# Altium project X-FBAPE.PrjPcb
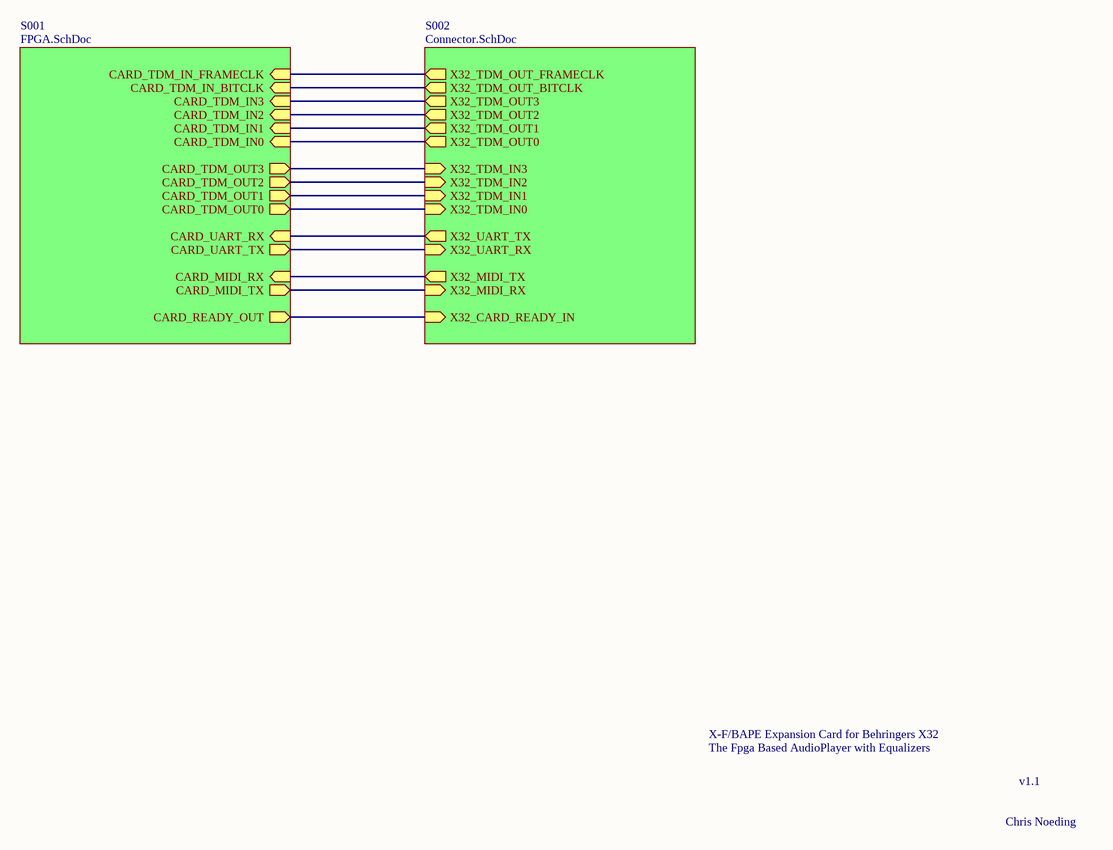
[diagram p0: Top.SchDoc]
3 sheets, 49 parts. Net scope: hierarchical (ports join the sheet entries above them; power ports are global).
Board file: X-FBAPE.PcbDoc
Sheets:
  Top.SchDoc
    S001 = FPGA.SchDoc
    S002 = Connector.SchDoc

## Sheet Top.SchDoc
size A4; SheetNumber: 1; SheetTotal: 3

### Sub-sheets
S001 = FPGA.SchDoc: CARD_TDM_IN_FRAMECLK (in), CARD_TDM_IN_BITCLK (in), CARD_TDM_IN3 (in), CARD_TDM_IN2 (in), CARD_TDM_IN1 (in), CARD_TDM_IN0 (in), CARD_TDM_OUT3 (out), CARD_TDM_OUT2 (out), CARD_TDM_OUT1 (out), CARD_TDM_OUT0 (out), CARD_UART_RX (in), CARD_UART_TX (out), CARD_MIDI_RX (in), CARD_MIDI_TX (out), CARD_READY_OUT (out)
S002 = Connector.SchDoc: X32_TDM_OUT_FRAMECLK (out), X32_TDM_OUT_BITCLK (out), X32_TDM_OUT3 (out), X32_TDM_OUT2 (out), X32_TDM_OUT1 (out), X32_TDM_OUT0 (out), X32_TDM_IN3 (in), X32_TDM_IN2 (in), X32_TDM_IN1 (in), X32_TDM_IN0 (in), X32_UART_TX (out), X32_UART_RX (in), X32_MIDI_TX (out), X32_MIDI_RX (in), X32_CARD_READY_IN (in)

### Nets
NetJ202_20: sheet S001/CARD_UART_TX, sheet S002/X32_UART_RX
NetJ202_21: sheet S001/CARD_UART_RX, sheet S002/X32_UART_TX
NetJ203_6: sheet S001/CARD_TDM_IN_FRAMECLK, sheet S002/X32_TDM_OUT_FRAMECLK
NetJ203_7: sheet S001/CARD_TDM_IN_BITCLK, sheet S002/X32_TDM_OUT_BITCLK
NetJ203_8: sheet S001/CARD_TDM_IN0, sheet S002/X32_TDM_OUT0
NetJ203_9: sheet S001/CARD_TDM_IN1, sheet S002/X32_TDM_OUT1
NetJ203_10: sheet S001/CARD_TDM_IN2, sheet S002/X32_TDM_OUT2
NetJ203_11: sheet S001/CARD_TDM_IN3, sheet S002/X32_TDM_OUT3
NetJ203_12: sheet S001/CARD_READY_OUT, sheet S002/X32_CARD_READY_IN
NetJ203_21: sheet S001/CARD_MIDI_TX, sheet S002/X32_MIDI_RX
NetJ203_22: sheet S001/CARD_MIDI_RX, sheet S002/X32_MIDI_TX
NetJ203_23: sheet S001/CARD_TDM_OUT3, sheet S002/X32_TDM_IN3
NetJ203_24: sheet S001/CARD_TDM_OUT2, sheet S002/X32_TDM_IN2
NetJ203_25: sheet S001/CARD_TDM_OUT1, sheet S002/X32_TDM_IN1
NetJ203_26: sheet S001/CARD_TDM_OUT0, sheet S002/X32_TDM_IN0

### Notes on the sheet
- X-F/BAPE Expansion Card for Behringers X32
- The Fpga Based AudioPlayer with Equalizers
- v1.1
- Chris Noeding

## Sheet FPGA.SchDoc
size A4; SheetNumber: 2; SheetTotal: 3
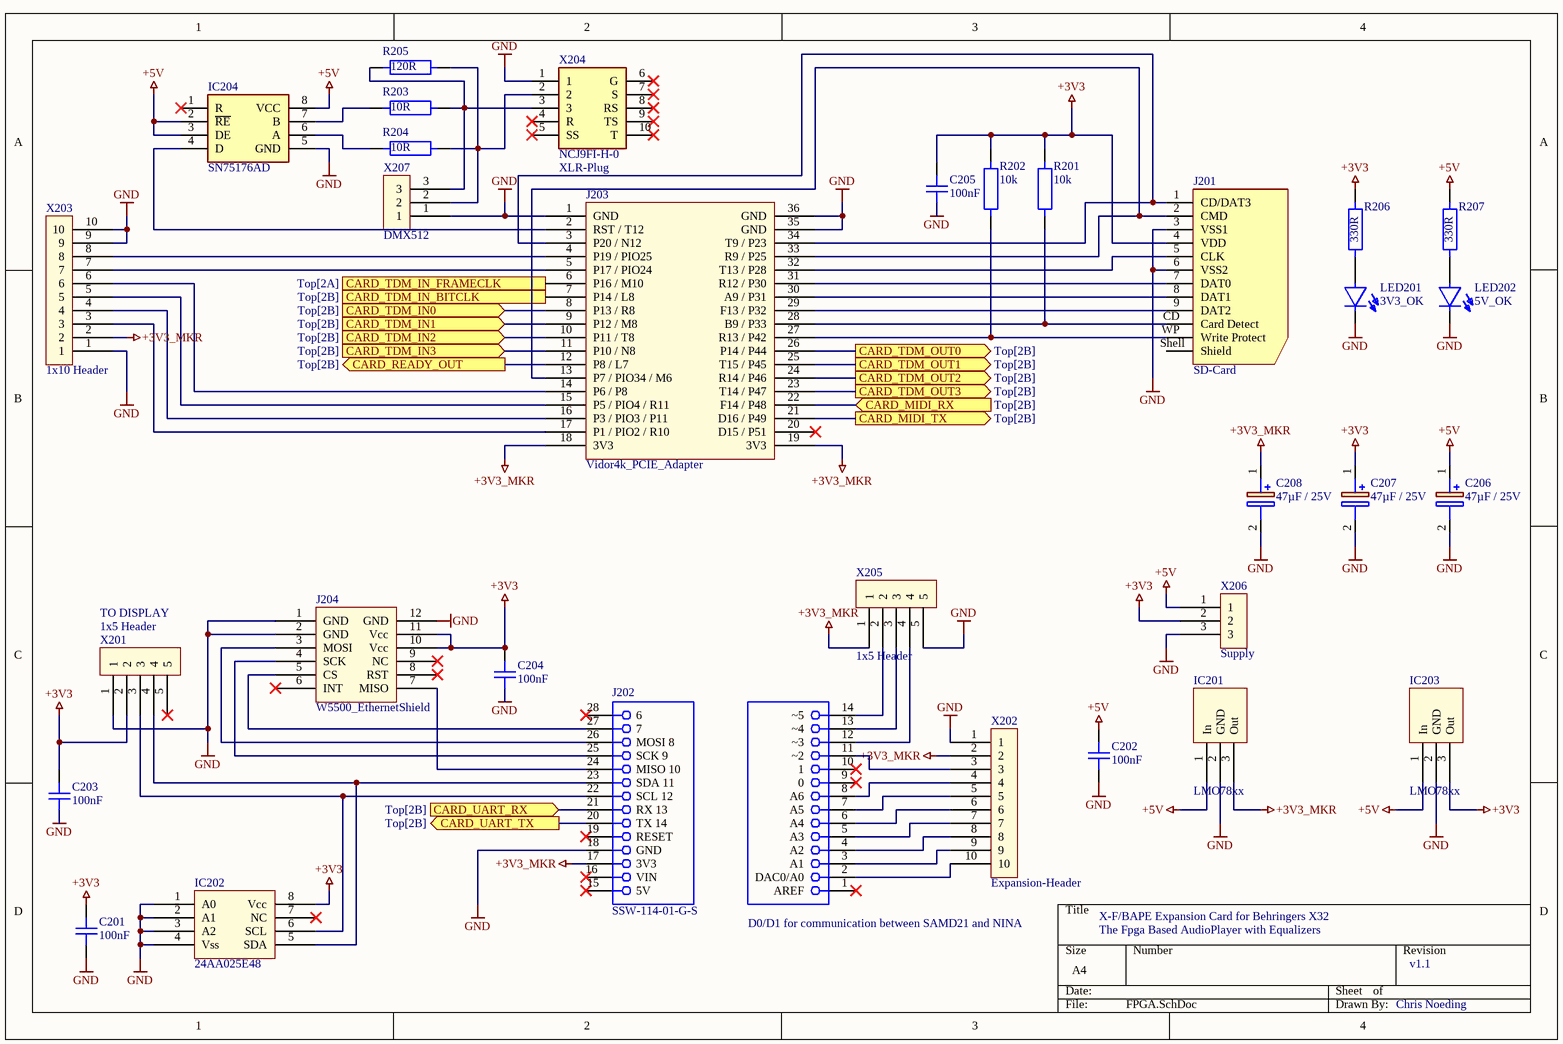
[diagram p1: FPGA.SchDoc]

### Parts
C201  100nF  [1206]
C202  100nF  [1206]
C203  100nF  [1206]
C204  100nF  [1206]
C205  100nF  [1206]
C206  47µF / 25V  [CAPPRD200W50D550H1250]
C207  47µF / 25V  [CAPPRD200W50D550H1250]
C208  47µF / 25V  [CAPPRD200W50D550H1250]
IC201  LMO78xx  [LMO78xx]
IC202  24AA025E48  [SOIC-8]
IC203  LMO78xx  [LMO78xx]
IC204  SN75176AD  [SOIC127P600X175-8N]
J201  693061010911  [693061010911]  (value not drawn)
J202  SSW-114-01-G-S  [SMTC-SSW-114-01-X-S]
J203  Vidor4k_PCIE_Adapter  [Vidor4K_PCIE_Adapter]
J204  W5500_EthernetShield  [W5500_EthernetShield]
LED201  3V3_OK  [LED 3MM]
LED202  5V_OK  [LED 3MM]
R201  10k  [1206]
R202  10k  [1206]
R203  10R  [1206]
R204  10R  [1206]
R205  120R  [1206]
R206  330R  [1206]
R207  330R  [1206]
X201  1x5 Header  [1x5 Header]
X202  Expansion-Header  [1x10 Header]
X203  1x10 Header  [1x10 Header]
X204  NCJ9FI-H-0  [NCJ9FIH0]
X205  1x5 Header  [1x5 Header]
X206  Supply  [1x3 Jumper]
X207  DMX512  [1x3 Jumper]

### Ports
CARD_MIDI_RX (in, see Top[2B]), CARD_MIDI_TX (out, see Top[2B]), CARD_READY_OUT (out, see Top[2B]), CARD_TDM_IN0 (in, see Top[2B]), CARD_TDM_IN1 (in, see Top[2B]), CARD_TDM_IN2 (in, see Top[2B]), CARD_TDM_IN3 (in, see Top[2B]), CARD_TDM_IN_BITCLK (in, see Top[2B]), CARD_TDM_IN_FRAMECLK (in, see Top[2A]), CARD_TDM_OUT0 (out, see Top[2B]), CARD_TDM_OUT1 (out, see Top[2B]), CARD_TDM_OUT2 (out, see Top[2B]), CARD_TDM_OUT3 (out, see Top[2B]), CARD_UART_RX (in, see Top[2B]), CARD_UART_TX (out, see Top[2B])

### Nets
+3V3: C201.1 C203.1 C204.1 C205.1 C207.1(+) IC202.8(Vcc) IC203.3(Out) J201.4(VDD) J204.10(Vcc) J204.11(Vcc) R201.2 R202.2 R206.1 X201.2 X206.2
+3V3_MKR: C208.1(+) IC201.3(Out) J202.17(3V3) J203.18(3V3) J203.19(3V3) X202.2 X203.2 X205.1
+5V: C202.1 C206.1(+) IC201.1(In) IC203.1(In) IC204.2(~{RE}) IC204.3(DE) IC204.8(VCC) R207.1 X206.1
GND: C201.2 C202.2 C203.2 C204.2 C205.2 C206.2(-) C207.2(-) C208.2(-) IC201.2(GND) IC202.1(A0) IC202.2(A1) IC202.3(A2) IC202.4(Vss) IC203.2(GND) IC204.5(GND) J201.3(VSS1) J201.6(VSS2) J202.18(GND) J203.1(GND) J203.35(GND) J203.36(GND) J204.1(GND) J204.2(GND) J204.12(GND) LED201.2 LED202.2 X201.1 X202.1 X203.1 X203.9 X203.10 X204.1 X205.5 X206.3 X207.1
NetIC202_5: IC202.5(SDA) J202.23(SDA_11) X201.4
NetIC202_6: IC202.6(SCL) J202.22(SCL_12) X201.3
NetIC204_4: IC204.4(D) J203.2(RST_/_T12)
NetIC204_6: IC204.6(A) R204.1
NetIC204_7: IC204.7(B) R203.1
NetJ201_1: J201.1(CD/DAT3) J203.3(P20_/_N12) J203.34(T9_/_P23)
NetJ201_2: J201.2(CMD) J203.13(P7_/_PIO34_/_M6) J203.33(R9_/_P25)
NetJ201_5: J201.5(CLK) J203.32(T13_/_P28)
NetJ201_7: J201.7(DAT0) J203.31(R12_/_P30)
NetJ201_8: J201.8(DAT1) J203.30(A9_/_P31)
NetJ201_9: J201.9(DAT2) J203.29(F13_/_P32)
NetJ201_CD: J201.CD(Card_Detect) J203.28(B9_/_P33) R201.1
NetJ201_WP: J201.WP(Write_Protect) J203.27(R13_/_P42) R202.1
NetJ202_2: J202.2(DAC0/A0) X202.10
NetJ202_3: J202.3(A1) X202.9
NetJ202_4: J202.4(A2) X202.8
NetJ202_5: J202.5(A3) X202.7
NetJ202_6: J202.6(A4) X202.6
NetJ202_7: J202.7(A5) X202.5
NetJ202_8: J202.8(A6) X202.4
NetJ202_11: J202.11(~2) X202.3
NetJ202_12: J202.12(~3) X205.4
NetJ202_13: J202.13(~4) X205.3
NetJ202_14: J202.14(~5) X205.2
NetJ202_20: J202.20(TX_14) ; port CARD_UART_TX
NetJ202_21: J202.21(RX_13) ; port CARD_UART_RX
NetJ202_24: J202.24(MISO_10) J204.7(MISO)
NetJ202_25: J202.25(SCK_9) J204.4(SCK)
NetJ202_26: J202.26(MOSI_8) J204.3(MOSI)
NetJ202_27: J202.27(7) J204.5(CS)
NetJ203_4: J203.4(P19_/_PIO25) X203.8
NetJ203_5: J203.5(P17_/_PIO24) X203.7
NetJ203_6: J203.6(P16_/_M10) ; port CARD_TDM_IN_FRAMECLK
NetJ203_7: J203.7(P14_/_L8) ; port CARD_TDM_IN_BITCLK
NetJ203_8: J203.8(P13_/_R8) ; port CARD_TDM_IN0
NetJ203_9: J203.9(P12_/_M8) ; port CARD_TDM_IN1
NetJ203_10: J203.10(P11_/_T8) ; port CARD_TDM_IN2
NetJ203_11: J203.11(P10_/_N8) ; port CARD_TDM_IN3
NetJ203_12: J203.12(P8_/_L7) ; port CARD_READY_OUT
NetJ203_14: J203.14(P6_/_P8) X203.6
NetJ203_15: J203.15(P5_/_PIO4_/_R11) X203.5
NetJ203_16: J203.16(P3_/_PIO3_/_P11) X203.4
NetJ203_17: J203.17(P1_/_PIO2_/_R10) X203.3
NetJ203_21: J203.21(D16_/_P49) ; port CARD_MIDI_TX
NetJ203_22: J203.22(F14_/_P48) ; port CARD_MIDI_RX
NetJ203_23: J203.23(T14_/_P47) ; port CARD_TDM_OUT3
NetJ203_24: J203.24(R14_/_P46) ; port CARD_TDM_OUT2
NetJ203_25: J203.25(T15_/_P45) ; port CARD_TDM_OUT1
NetJ203_26: J203.26(P14_/_P44) ; port CARD_TDM_OUT0
NetLED201_1: LED201.1 R206.2
NetLED202_1: LED202.1 R207.2
NetR203_2: R203.2 R205.1 X204.3 X207.3
NetR204_2: R204.2 R205.2 X204.2 X207.2

Not connected (* = marked no-connect by the designer): IC202 7(NC)*; IC204 1(R)*; J201 Shell(Shield); J202 1(AREF)* 9(0)* 10(1)* 15(5V)* 16(VIN)* 19(RESET)* 28(6)*; J203 20(D15_/_P51)*; J204 6(INT)* 8(RST)* 9(NC)*; X201 5*; X204 4(R)* 5(SS)* 6(G)* 7(S)* 8(RS)* 9(TS)* 10(T)*

### Notes on the sheet
- XLR-Plug
- (near J201) SD-Card
- TO DISPLAY
- (near J202) D0/D1 for communication between SAMD21 and NINA
- X-F/BAPE Expansion Card for Behringers X32
- The Fpga Based AudioPlayer with Equalizers
- v1.1
- Chris Noeding

### Library data of the parts
C201-C205 = 1206_C_1nF/63V: 1206_C; Text Field1: 06-23225; SMA-ArtikelNr: *
C206-C208 = MAL214256479E3: Capacitor Polarised; Manufacturer_Name: Vishay; Datasheet Link: https://www.vishay.com/docs/28402/142rhs.pdf; Height: 12.5mm; Manufacturer_Part_Number: MAL214256479E3
IC204 = SN75176AD: Integrated Circuit; Manufacturer_Name: Texas Instruments; Datasheet Link: http://www.ti.com/lit/ds/symlink/sn75176a.pdf; Height: 1.75mm; Manufacturer_Part_Number: SN75176AD; Mouser Part Number: 595-SN75176AD; Mouser Price/Stock: https://www.mouser.co.uk/ProductDetail/Texas-Instruments/SN75176AD?qs=FetendrIl6upbSVFRObzhQ%3D%3D; Arrow Part Number: SN75176AD; Arrow Price/Stock: https://www.arrow.com/en/products/sn75176ad/texas-instruments?region=nac
J201 = 693061010911: WR-CRD SD Card Connector Push & Push with Card Detection; Manufacturer: Wurth Elektronik; Contact Resistance: 100mOhm; Gender: Socket; Rated Current: 0.5A; Working Voltage: 100VAC; Withstanding Voltage: 500VAC; Manufacturer Part Number: 693061010911; Category: Input/Output Connectors; Match Code: WR-CRD; ComponentLink1Description: Website Link; ComponentLink1URL: https://www.we-online.com/redexpert/article/693061010911?ad; ComponentLink2Description: Datasheet Link; ComponentLink2URL: https://www.we-online.com/redexpert/spec/693061010911?ad; Mount: Surface Mount; Operating Temperature Max: 85°C; Operating Temperature Min: -25°C; Packaging: Tape and Reel; Number of Pins: 9; Type: Push & Push
J202 = Arduino MKR Vidor 4000: SQ Post Socket, Through-hole, Vertical, -55 to 125 degC, 2.54 mm Pitch, 14-Pin, Female, RoHS; Manufacturer: Samtec; Pitch: 2.54 mm; PackageVersion: CA, 6/1987; Mounting Technology: Through-hole; Temperature Range: -55 to 125 degC; Orientation: Vertical; PackageDescription: Assembly, Socket Strip .016 X .031 Tail; ComponentLink1URL: http://www.samtec.com; ComponentLink2URL: http://www.samtec.com/documents/webfiles/pdf/SSW_TH.PDF; ComponentLink1Description: Manufacturer URL; ComponentLink3Description: Package Specification; ComponentLink3URL: http://www.samtec.com/documents/webfiles/cpdf/SSW-1XX-XX-XXX-X-XX-XXX-XX-MKT.pdf; ComponentLink2Description: Datasheet; RoHS: True; PartNumber: SSW-114-01-G-S; PackageReference: SSW-114-01-X-S; DatasheetVersion: F-214
LED201 LED202 = LED 3MM
R201-R207 = 1206_R: SMA-ArtikelNr: *
X202 = 1x10 Header
X204 = NCJ9FI-H-0: Connector; Manufacturer_Name: Neutrik; Datasheet Link: https://www.neutrik.com/en/product/ncj9fi-h-0; Height: 30mm; Manufacturer_Part_Number: NCJ9FI-H-0; Mouser Part Number: 568-NCJ9FI-H-O; Mouser Price/Stock: https://www.mouser.co.uk/ProductDetail/Neutrik/NCJ9FI-H-0?qs=MO8z%252B%252BLepAGe50nSvUmG8A%3D%3D; Arrow Part Number: NCJ9FI-H-0; Arrow Price/Stock: https://www.arrow.com/en/products/ncj9fi-h-0/neutrik-group?utm_currency=USD&region=europe
X206 X207 = 1x3 Jumper

## Sheet Connector.SchDoc
size A4; SheetNumber: 3; SheetTotal: 3
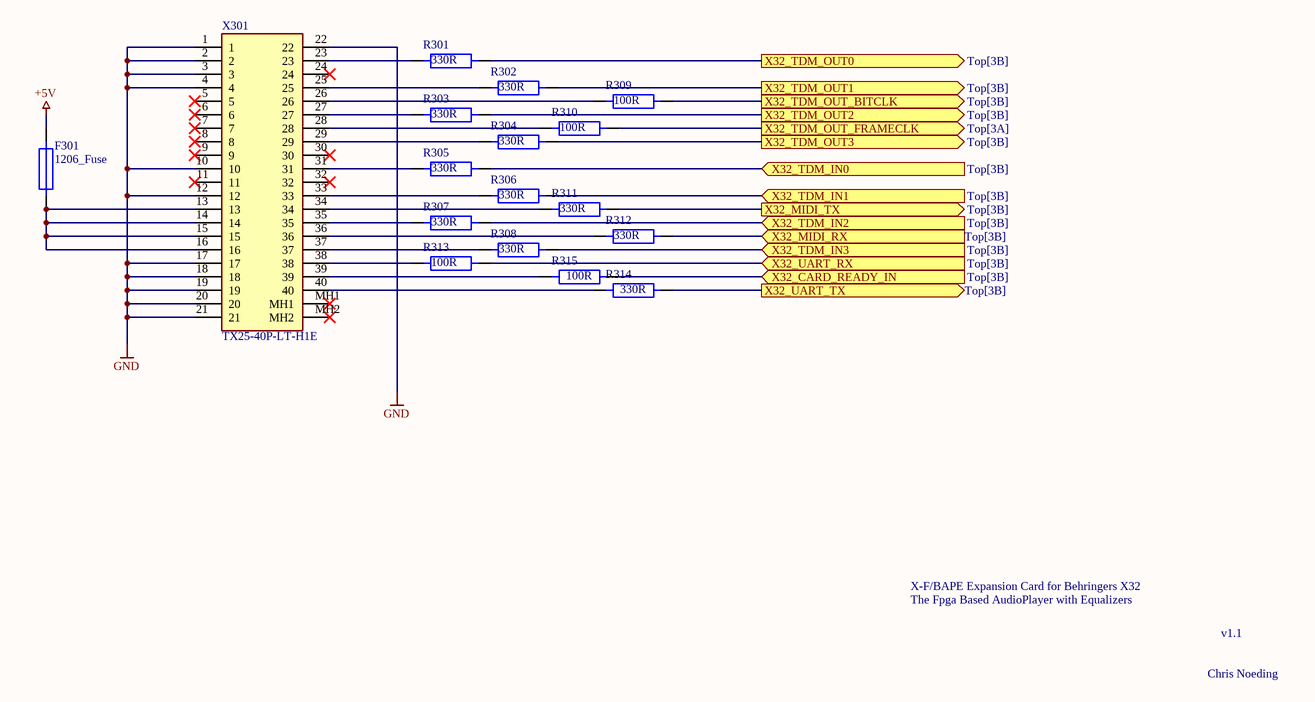
[diagram p2: Connector.SchDoc]

### Parts
F301  1206_Fuse  [1206]
R301  330R  [1206]
R302  330R  [1206]
R303  330R  [1206]
R304  330R  [1206]
R305  330R  [1206]
R306  330R  [1206]
R307  330R  [1206]
R308  330R  [1206]
R309  100R  [1206]
R310  100R  [1206]
R311  330R  [1206]
R312  330R  [1206]
R313  100R  [1206]
R314  330R  [1206]
R315  100R  [1206]
X301  TX25-40P-LT-H1E  [TX2540PLTH1E]

### Ports
X32_CARD_READY_IN (in, see Top[3B]), X32_MIDI_RX (in, see Top[3B]), X32_MIDI_TX (out, see Top[3B]), X32_TDM_IN0 (in, see Top[3B]), X32_TDM_IN1 (in, see Top[3B]), X32_TDM_IN2 (in, see Top[3B]), X32_TDM_IN3 (in, see Top[3B]), X32_TDM_OUT0 (out, see Top[3B]), X32_TDM_OUT1 (out, see Top[3B]), X32_TDM_OUT2 (out, see Top[3B]), X32_TDM_OUT3 (out, see Top[3B]), X32_TDM_OUT_BITCLK (out, see Top[3B]), X32_TDM_OUT_FRAMECLK (out, see Top[3A]), X32_UART_RX (in, see Top[3B]), X32_UART_TX (out, see Top[3B])

### Nets
+5V: F301.2
GND: X301.1 X301.2 X301.3 X301.4 X301.10 X301.12 X301.17 X301.18 X301.19 X301.20 X301.21 X301.22
NetF301_1: F301.1 X301.13 X301.14 X301.15 X301.16
NetJ202_20: R313.2 ; port X32_UART_RX
NetJ202_21: R314.2 ; port X32_UART_TX
NetJ203_6: R310.2 ; port X32_TDM_OUT_FRAMECLK
NetJ203_7: R309.2 ; port X32_TDM_OUT_BITCLK
NetJ203_8: R301.2 ; port X32_TDM_OUT0
NetJ203_9: R302.2 ; port X32_TDM_OUT1
NetJ203_10: R303.2 ; port X32_TDM_OUT2
NetJ203_11: R304.2 ; port X32_TDM_OUT3
NetJ203_12: R315.2 ; port X32_CARD_READY_IN
NetJ203_21: R312.2 ; port X32_MIDI_RX
NetJ203_22: R311.2 ; port X32_MIDI_TX
NetJ203_23: R308.2 ; port X32_TDM_IN3
NetJ203_24: R307.2 ; port X32_TDM_IN2
NetJ203_25: R306.2 ; port X32_TDM_IN1
NetJ203_26: R305.2 ; port X32_TDM_IN0
NetR301_1: R301.1 X301.23
NetR302_1: R302.1 X301.25
NetR303_1: R303.1 X301.27
NetR304_1: R304.1 X301.29
NetR305_1: R305.1 X301.31
NetR306_1: R306.1 X301.33
NetR307_1: R307.1 X301.35
NetR308_1: R308.1 X301.37
NetR309_1: R309.1 X301.26
NetR310_1: R310.1 X301.28
NetR311_1: R311.1 X301.34
NetR312_1: R312.1 X301.36
NetR313_1: R313.1 X301.38
NetR314_1: R314.1 X301.40
NetR315_1: R315.1 X301.39

Not connected (* = marked no-connect by the designer): X301 5* 6* 7* 8* 9* 11* 24* 30* 32* MH1* MH2*

### Notes on the sheet
- X-F/BAPE Expansion Card for Behringers X32
- The Fpga Based AudioPlayer with Equalizers
- v1.1
- Chris Noeding

### Library data of the parts
R301-R315 = 1206_R: SMA-ArtikelNr: *
X301 = TX25-40P-LT-H1E: Connector; Manufacturer_Name: JAE; Datasheet Link: https://www.jae.com/direct/topics/topics_file_download/topics_id=66792&ext_no=06&_lang=en&v=; Height: 9.2mm; Manufacturer_Part_Number: TX25-40P-LT-H1E; Mouser Part Number: 656-TX25-40P-LT-H1E; Mouser Price/Stock: https://www.mouser.co.uk/ProductDetail/JAE-Electronics/TX25-40P-LT-H1E?qs=v6Q0fmNAKahRjvRadE7n5w%3D%3D
F301 = 1206_Fuse: SMA-ArtikelNr: *

## Nets that join several sheets
+5V: FPGA (9 pins), Connector (F301.2)
GND: FPGA (35 pins), Connector (12 pins)
NetJ202_20: FPGA (J202.20), Connector (R313.2)
NetJ202_21: FPGA (J202.21), Connector (R314.2)
NetJ203_6: FPGA (J203.6), Connector (R310.2)
NetJ203_7: FPGA (J203.7), Connector (R309.2)
NetJ203_8: FPGA (J203.8), Connector (R301.2)
NetJ203_9: FPGA (J203.9), Connector (R302.2)
NetJ203_10: FPGA (J203.10), Connector (R303.2)
NetJ203_11: FPGA (J203.11), Connector (R304.2)
NetJ203_12: FPGA (J203.12), Connector (R315.2)
NetJ203_21: FPGA (J203.21), Connector (R312.2)
NetJ203_22: FPGA (J203.22), Connector (R311.2)
NetJ203_23: FPGA (J203.23), Connector (R308.2)
NetJ203_24: FPGA (J203.24), Connector (R307.2)
NetJ203_25: FPGA (J203.25), Connector (R306.2)
NetJ203_26: FPGA (J203.26), Connector (R305.2)